# EAGLE design hat_v2 (EAGLE 9.0.1)
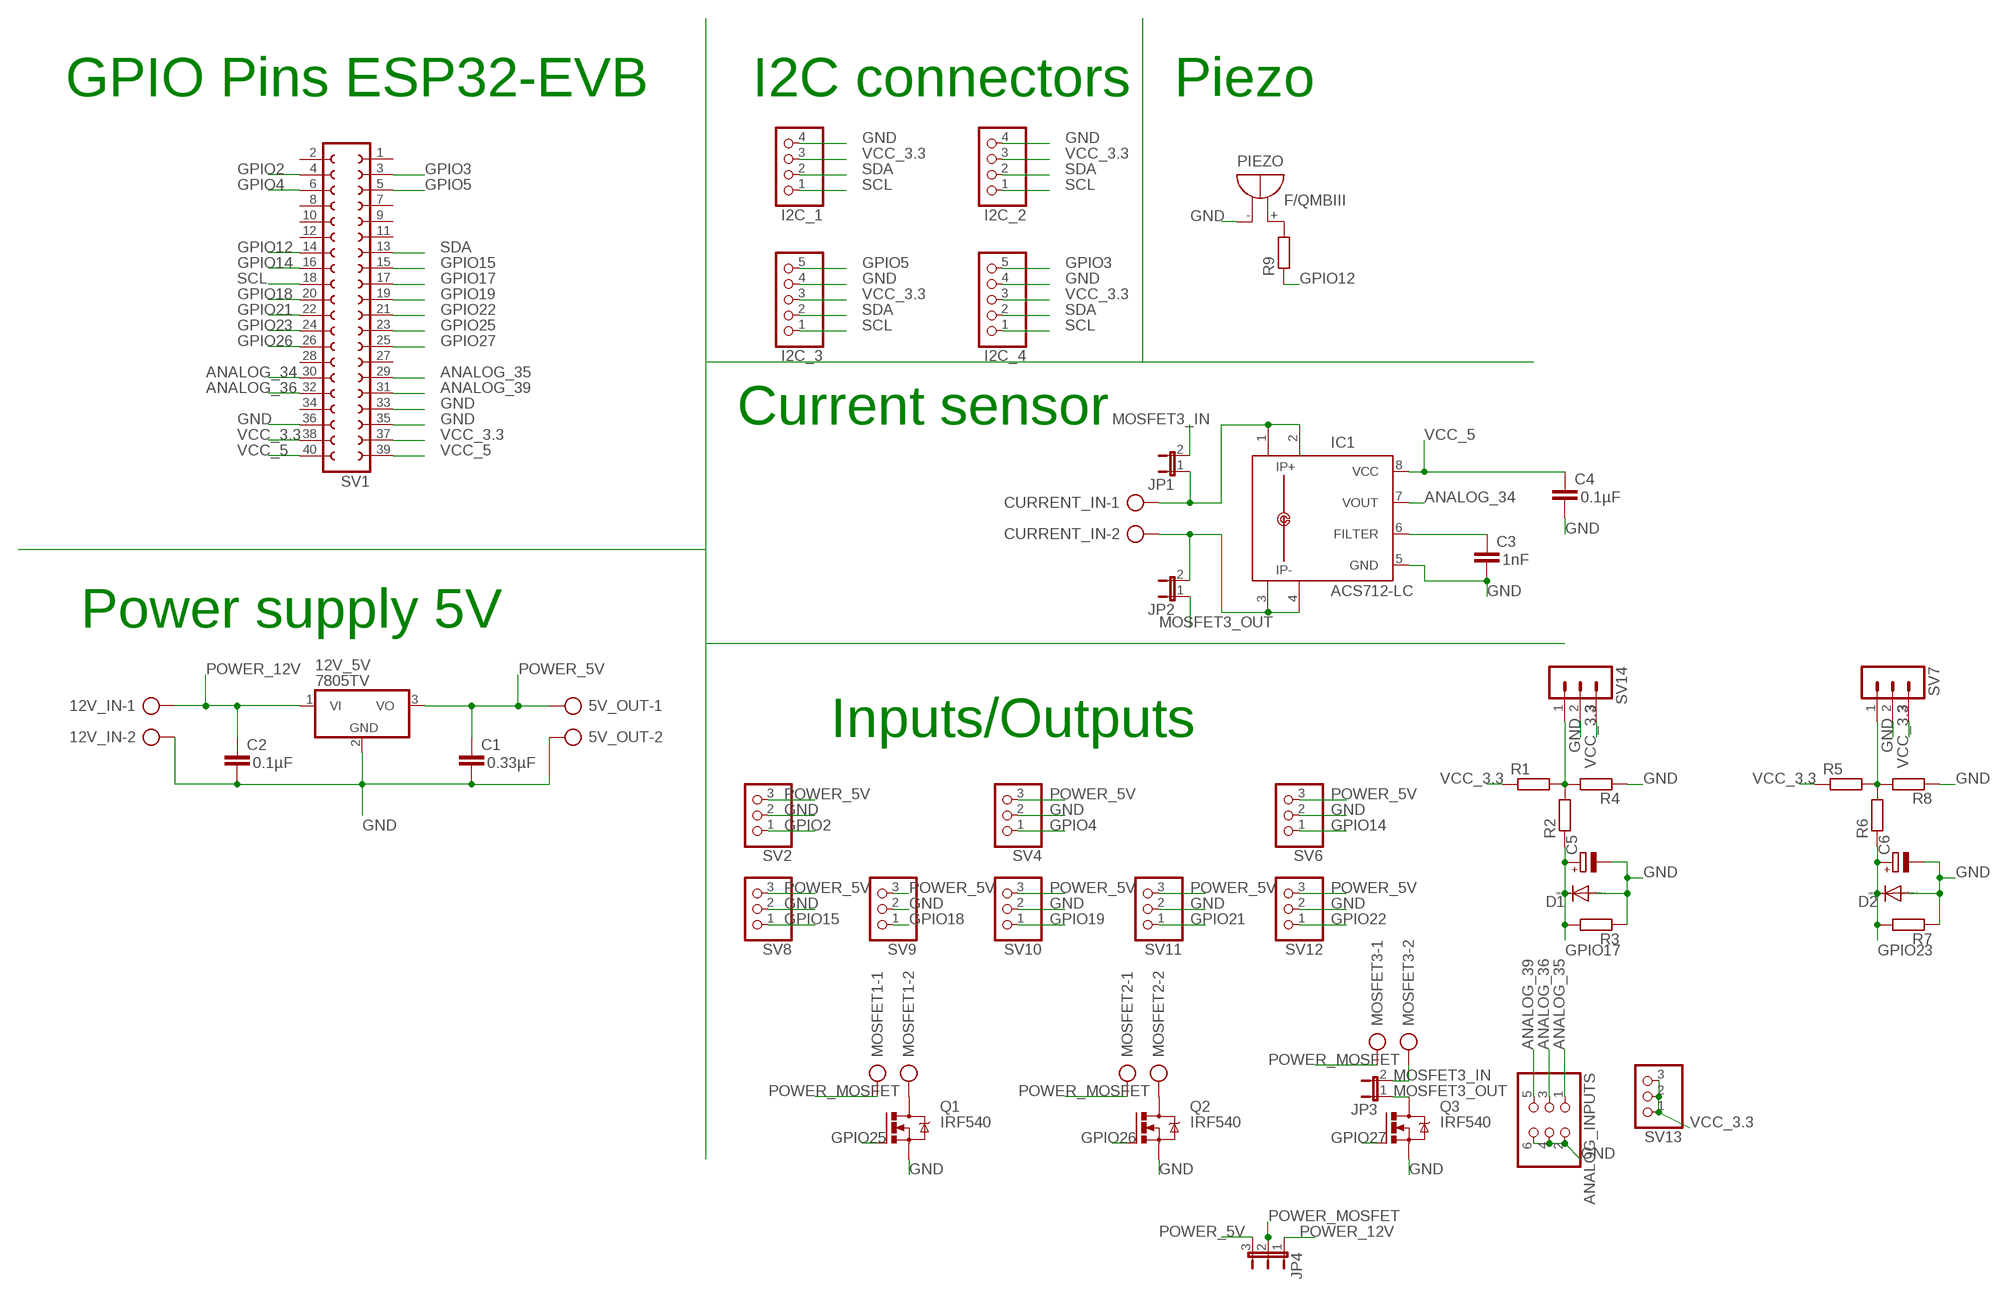
[diagram p0: schematic, sheet 1]

## Parts
5V_OUT  AK500/2  [AK500/2]
12V_5V  7805TV  [TO220V]
12V_IN  AK500/2  [AK500/2]
ANALOG_INPUTS  PINHD-2X3  [2X03]
C1  C-EU050-050X075  [C050-050X075]
C2  C-EU050-035X075  [C050-035X075]
C3  C-EU025-025X050  [C025-025X050]
C4  C-EU025-025X050  [C025-025X050]
C5  CPOL-EUE2.5-6  [E2,5-6]
C6  CPOL-EUE2.5-6  [E2,5-6]
CURRENT_IN  AK500/2  [AK500/2]
D1  DIODE-C1702-05  [C1702-05]
D2  DIODE-C1702-05  [C1702-05]
I2C_1  PINHD-1X4  [1X04]
I2C_2  PINHD-1X4  [1X04]
I2C_3  PINHD-1X5  [1X05]
I2C_4  PINHD-1X5  [1X05]
IC1  ACS712-LC  [SOIC8]
JP1  JP1E  [JP1]
JP2  JP1E  [JP1]
JP3  JP1E  [JP1]
JP4  JP2E  [JP2]
MOSFET1  AK500/2  [AK500/2]
MOSFET2  AK500/2  [AK500/2]
MOSFET3  AK500/2  [AK500/2]
PIEZO  F/QMBIII  [F/QMBIII]
Q1  IRF540  [TO220BV]
Q2  IRF540  [TO220BV]
Q3  IRF540  [TO220BV]
R1  R-EU_0207/2V  [0207/2V]
R2  R-EU_0207/2V  [0207/2V]
R3  R-EU_0207/2V  [0207/2V]
R4  R-EU_0617/5V  [0617V]
R5  R-EU_0207/2V  [0207/2V]
R6  R-EU_0207/2V  [0207/2V]
R7  R-EU_0207/2V  [0207/2V]
R8  R-EU_0617/5V  [0617V]
R9  R-EU_0207/5V  [0207/5V]
SV1  FE20-2  [FE20-2]
SV2  PINHD-1X3  [1X03]
SV4  PINHD-1X3  [1X03]
SV6  PINHD-1X3  [1X03]
SV7  MA03-1  [MA03-1]
SV8  PINHD-1X3  [1X03]
SV9  PINHD-1X3  [1X03]
SV10  PINHD-1X3  [1X03]
SV11  PINHD-1X3  [1X03]
SV12  PINHD-1X3  [1X03]
SV13  PINHD-1X3  [1X03]
SV14  MA03-1  [MA03-1]

## Nets
ANALOG_34: IC1.7(VOUT) SV1.30
ANALOG_35: ANALOG_INPUTS.1 SV1.29
ANALOG_36: ANALOG_INPUTS.3 SV1.32
ANALOG_39: ANALOG_INPUTS.5 SV1.31
GND: 5V_OUT.2 12V_5V.2(GND) 12V_IN.2 ANALOG_INPUTS.2 ANALOG_INPUTS.4 ANALOG_INPUTS.6 C1.2 C2.2 C3.2 C4.2 C5.- C6.- D1.A D2.A I2C_1.4 I2C_2.4 I2C_3.4 I2C_4.4 IC1.5(GND) PIEZO.-(+) Q1.S Q2.S Q3.S R3.1 R4.1 R7.1 R8.1 SV1.33 SV1.35 SV1.36 SV2.2 SV4.2 SV6.2 SV7.2 SV8.2 SV9.2 SV10.2 SV11.2 SV12.2 SV14.2
GPIO2: SV1.4 SV2.1
GPIO3: I2C_4.5 SV1.3
GPIO4: SV1.6 SV4.1
GPIO5: I2C_3.5 SV1.5
GPIO12: R9.1 SV1.14
GPIO14: SV1.16 SV6.1
GPIO15: SV1.15 SV8.1
GPIO17: C5.+ D1.C R2.1 R3.2 SV1.17
GPIO18: SV1.20 SV9.1
GPIO19: SV1.19 SV10.1
GPIO21: SV1.22 SV11.1
GPIO22: SV1.21 SV12.1
GPIO23: C6.+ D2.C R6.1 R7.2 SV1.24
GPIO25: Q1.G SV1.23
GPIO26: Q2.G SV1.26
GPIO27: Q3.G SV1.25
MOSFET3_IN: JP1.2 JP3.2 MOSFET3.2
MOSFET3_OUT: JP2.1 JP3.1 Q3.D
N$4: MOSFET1.2 Q1.D
N$5: MOSFET2.2 Q2.D
N$7: CURRENT_IN.1 IC1.1(IP+) IC1.2(IP+1) JP1.1
N$8: CURRENT_IN.2 IC1.3(IP-) IC1.4(IP-1) JP2.2
N$9: R1.2 R2.2 R4.2 SV14.1
N$10: R5.2 R6.2 R8.2 SV7.1
N$11: C3.1 IC1.6(FILTER)
N$12: PIEZO.+(-) R9.2
POWER_5V: 5V_OUT.1 12V_5V.3(VO) C1.1 JP4.3 SV2.3 SV4.3 SV6.3 SV8.3 SV9.3 SV10.3 SV11.3 SV12.3
POWER_12V: 12V_5V.1(VI) 12V_IN.1 C2.1 JP4.1
POWER_MOSFET: JP4.2 MOSFET1.1 MOSFET2.1 MOSFET3.1
SCL: I2C_1.1 I2C_2.1 I2C_3.1 I2C_4.1 SV1.18
SDA: I2C_1.2 I2C_2.2 I2C_3.2 I2C_4.2 SV1.13
VCC_3.3: I2C_1.3 I2C_2.3 I2C_3.3 I2C_4.3 R1.1 R5.1 SV1.37 SV1.38 SV7.3 SV13.1 SV13.2 SV13.3 SV14.3
VCC_5: C4.1 IC1.8(VCC) SV1.39 SV1.40
Unconnected: SV1.1 SV1.2 SV1.7 SV1.8 SV1.9 SV1.10 SV1.11 SV1.12 SV1.27 SV1.28 SV1.34

## Notes on the sheet
- GPIO Pins ESP32-EVB | I2C connectors | Piezo
- Current sensor
- Power supply 5V
- Inputs/Outputs

## Library data of the parts
5V_OUT 12V_IN CURRENT_IN MOSFET1-MOSFET3 = con-ptr500:AK500/2: CONNECTOR; OC_FARNELL: unknown; OC_NEWARK: unknown
12V_5V = linear:78*: Positive VOLTAGE REGULATOR Source: http://cache.national.com/ds/LM/LM78L05.pdf http://www.fairchildsemi.com/ds/LM/LM7805.pdf
ANALOG_INPUTS = pinhead:PINHD-2X3: PIN HEADER
C1 = resistor:C-EU: CAPACITOR, European symbol; C1: 0.33µF
C2 = resistor:C-EU: CAPACITOR, European symbol; C2: 0.1µF
C3 = rcl:C-EU: CAPACITOR, European symbol; SPICEPREFIX: 1nF
C4 = rcl:C-EU: CAPACITOR, European symbol; SPICEPREFIX: 0.1µF
C5 C6 = rcl:CPOL-EU: POLARIZED CAPACITOR, European symbol; SPICEPREFIX: C
D1 D2 = diode:DIODE-: DIODE
I2C_1 I2C_2 = pinhead:PINHD-1X4: PIN HEADER
I2C_3 I2C_4 = pinhead:PINHD-1X5: PIN HEADER
IC1 = allegro-2:ACS712-LC
JP1-JP3 = jumper:JP1E: JUMPER
JP4 = jumper:JP2E: JUMPER
PIEZO = buzzer:F/QMBIII: BUZZER Source: Buerklin; OC_FARNELL: unknown; OC_NEWARK: unknown
Q1-Q3 = transistor-power:IRF540: HEXFET Power MOSFET
R1-R9 = rcl:R-EU_: RESISTOR, European symbol; SPICEPREFIX: R
SV1 = con-lsta:FE20-2: FEMALE HEADER; OC_FARNELL: unknown; OC_NEWARK: unknown
SV2 SV4 SV6 SV9-SV12 = pinhead:PINHD-1X3: PIN HEADER; SPICEPREFIX: J
SV7 SV14 = con-lstb:MA03-1: PIN HEADER; OC_FARNELL: unknown; OC_NEWARK: unknown; SPICEPREFIX: J
SV8 SV13 = pinhead:PINHD-1X3: PIN HEADER

## Board
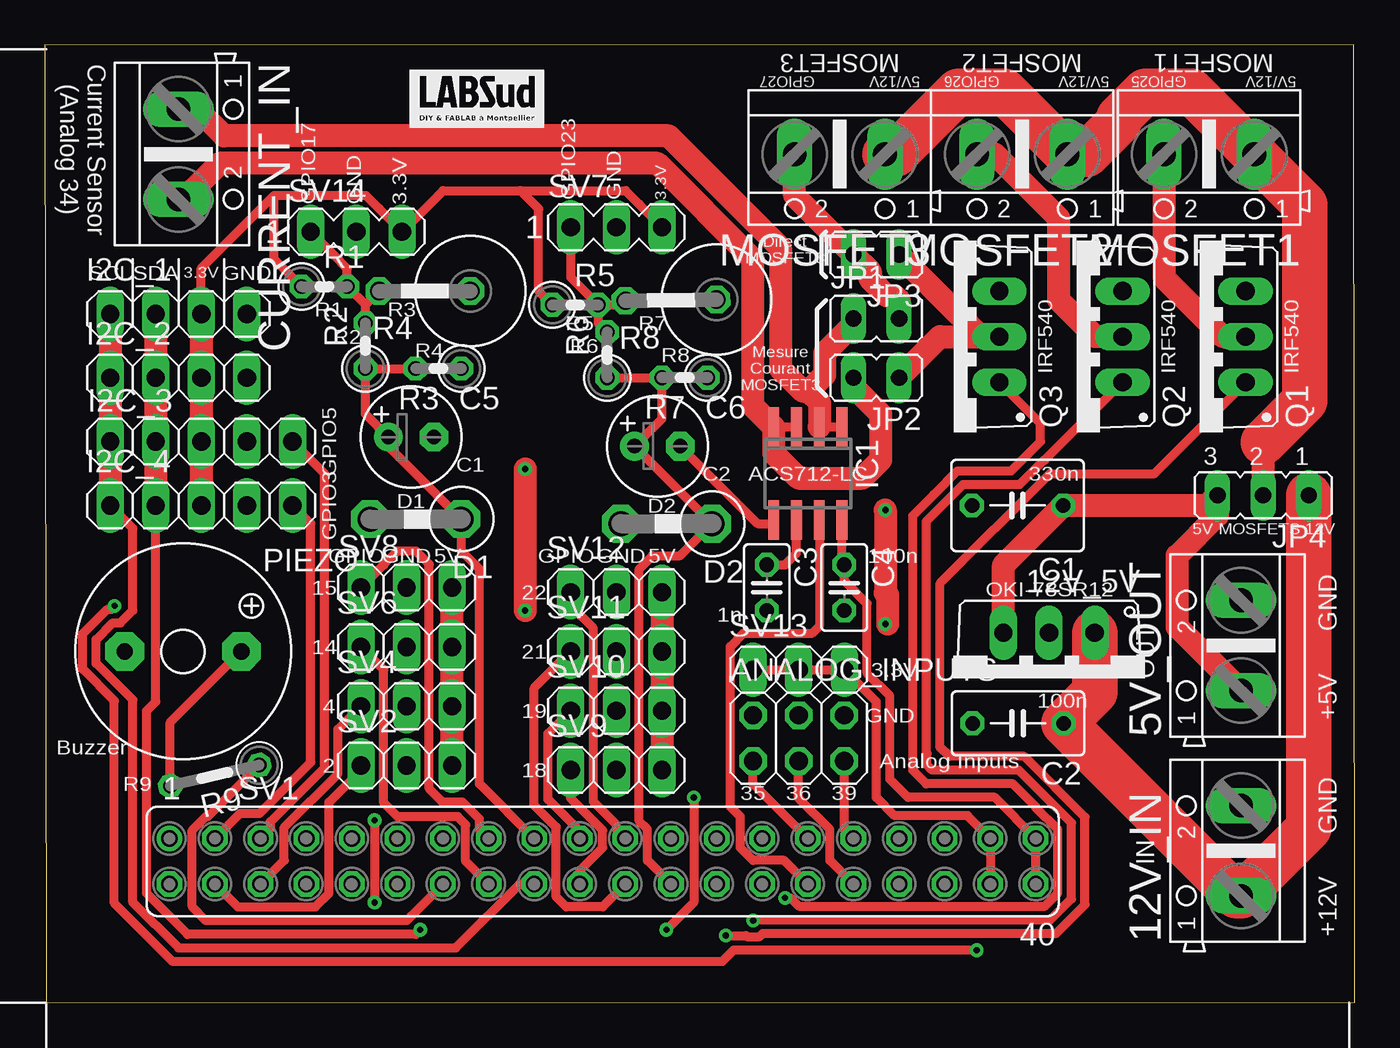
[diagram p1: board, top side]
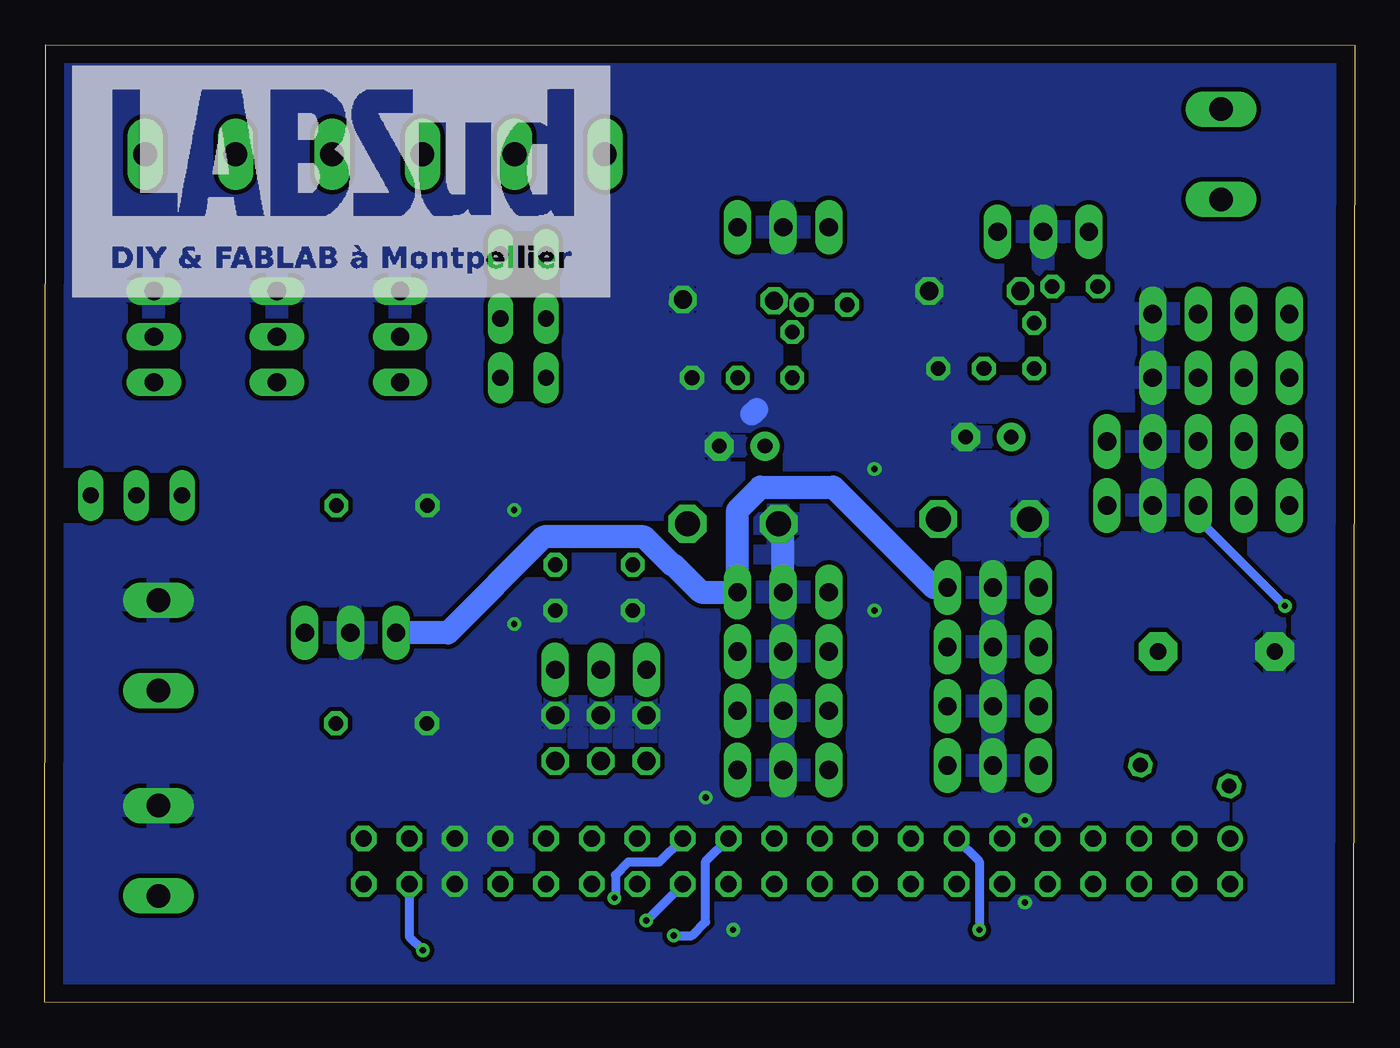
[diagram p2: board, bottom side, seen from below]

Size 72.95 x 53.33 mm. Coordinates in mm from the lower left corner, seen from the top.
Outline: 0.08,0 72.95,0.04 72.9,53.33 0,53.3 0.08,0
Copper layers (1*16): Top 0.035mm / dielectric 1.5mm / Bottom 0.035mm
Design rules "default *": minimum track width 6mil, minimum drill 0.35mm, track to track 10mil, track to pad 10mil, pad to pad 10mil, via to via 10mil, smd to smd 10mil, copper to edge 40mil, drill to drill 6mil, minimum pad ring 10mil, minimum via ring 8mil, stop-mask expansion 4mil, vias tented up to drill 0mil, thermal gap 10mil

### Footprints (pad centres in the part's own frame; a part is rotated, then mirrored left to right if it is on the bottom)
AK500/2 = drill 1.321 long: 1 -2.515,0; 2 2.515,0
TO220V = drill 1.016 long: 1 -2.54,-2.54; 2 0,-2.54; 3 2.54,-2.54
2X03 = drill 1.016 octagon: 1 -2.54,-1.27; 2 -2.54,1.27; 3 0,-1.27; 4 0,1.27; 5 2.54,-1.27; 6 2.54,1.27
C050-050X075 = drill 0.813 octagon: 1 -2.54,0; 2 2.54,0
C050-035X075 = drill 0.813 octagon: 1 -2.54,0; 2 2.54,0
C025-025X050 = drill 0.813 octagon: 1 -1.27,0; 2 1.27,0
E2,5-6 = drill 0.813 pad 1.6: + -1.27,0 | drill 0.813 pad 1.6 octagon: - 1.27,0
C1702-05 = drill 1.397 octagon: A 2.54,0; C -2.54,0
1X04 = drill 1.016 long: 1 -3.81,0; 2 -1.27,0; 3 1.27,0; 4 3.81,0
1X05 = drill 1.016 long: 1 -5.08,0; 2 -2.54,0; 3 0,0; 4 2.54,0; 5 5.08,0
SOIC8 = smd 0.6 x 2.2: 1 -1.905,-2.6; 2 -0.635,-2.6; 3 0.635,-2.6; 4 1.905,-2.6; 5 1.905,2.6; 6 0.635,2.6; 7 -0.635,2.6; 8 -1.905,2.6
JP1 = drill 0.914 long: 1 0,-1.27; 2 0,1.27
JP2 = drill 0.914 long: 1 -2.54,0; 2 0,0; 3 2.54,0
F/QMBIII = drill 0.914 pad 2.159 octagon: + 3.251,0; - -3.251,0
TO220BV = drill 1.016 long: D 0,-2.54; G -2.54,-2.54; S 2.54,-2.54
0207/2V = drill 0.813 octagon: 1 -1.27,0; 2 1.27,0
0617V = drill 1.016 octagon: 1 -2.54,0; 2 2.54,0
0207/5V = drill 0.813 octagon: 1 -2.54,0; 2 2.54,0
FE20-2 = drill 0.914: 1 -24.13,1.27 | drill 0.914 octagon: 2 -24.13,-1.27; 3 -21.59,1.27; 4 -21.59,-1.27; 5 -19.05,1.27; 6 -19.05,-1.27; 7 -16.51,1.27; 8 -16.51,-1.27; 9 -13.97,1.27; 10 -13.97,-1.27; 11 -11.43,1.27; 12 -11.43,-1.27; 13 -8.89,1.27; 14 -8.89,-1.27; 15 -6.35,1.27; 16 -6.35,-1.27; 17 -3.81,1.27; 18 -3.81,-1.27; 19 -1.27,1.27; 20 -1.27,-1.27; 21 1.27,1.27; 22 1.27,-1.27; 23 3.81,1.27; 24 3.81,-1.27; 25 6.35,1.27; 26 6.35,-1.27; 27 8.89,1.27; 28 8.89,-1.27; 29 11.43,1.27; 30 11.43,-1.27; 31 13.97,1.27; 32 13.97,-1.27; 33 16.51,1.27; 34 16.51,-1.27; 35 19.05,1.27; 36 19.05,-1.27; 37 21.59,1.27; 38 21.59,-1.27; 39 24.13,1.27; 40 24.13,-1.27
1X03 = drill 1.016 long: 1 -2.54,0; 2 0,0; 3 2.54,0
MA03-1 = drill 1.016 long: 1 -2.54,0; 2 0,0; 3 2.54,0

### Placement (x,y rotation side)
5V_OUT  66.62,19.89 90 top
12V_5V  55.93,18.06 180 top
12V_IN  66.62,8.46 90 top
ANALOG_INPUTS  41.99,14.73 0 top
C1  54.18,27.69 180 top
C2  54.2,15.56 180 top
C3  40.21,23.11 270 top
C4  44.53,23.11 270 top
C5  20.4,31.5 0 top
C6  34.11,30.99 0 top
CURRENT_IN  7.44,47.24 270 top
D1  20.65,26.92 180 top
D2  34.62,26.67 180 top
I2C_1  7.44,38.35 0 top
I2C_2  7.44,34.8 0 top
I2C_3  8.71,31.24 0 top
I2C_4  8.71,27.69 0 top
IC1  42.49,29.46 180 top
JP1  46.3,38.1 270 top
JP2  46.3,34.8 90 top
JP3  46.3,41.66 90 top
JP4  67.85,28.25 180 top
MOSFET1  64.85,47.24 180 top
MOSFET2  54.43,47.24 180 top
MOSFET3  44.27,47.24 180 top
PIEZO  7.7,19.56 0 top
Q1  64.34,37.08 90 top
Q2  57.48,37.08 90 top
Q3  50.62,37.08 90 top
R1  15.57,39.88 0 top
R2  17.86,36.58 90 top
R3  21.92,35.31 180 top
R4  21.16,39.62 180 top
R5  29.54,38.86 0 top
R6  31.32,36.07 90 top
R7  35.64,34.8 180 top
R8  34.87,39.12 180.8 top
R9  9.46,12.65 193.2 top
SV1  31.06,7.87 0 top
SV2  20.14,13.21 0 top
SV4  20.14,16.51 0 top
SV6  20.14,19.81 0 top
SV7  31.83,43.18 0 top
SV8  20.14,23.11 0 top
SV9  31.83,12.95 0 top
SV10  31.83,16.26 0 top
SV11  31.83,19.56 0 top
SV12  31.83,22.86 0 top
SV13  41.99,18.54 0 top
SV14  17.35,42.93 0 top
U$1  [LABSUD_MID]  71.46,39.24 0 bottom
U$2  [LABSUD_MINI]  20.31,48.7 0 top

### Tracks (layer width: path | path; a pad name or v marks a point on that pad's centre or on a via)
ANALOG_34
  Top 0.508: SV1.30 41.17,7.92 39.45,7.92 38.74,8.64 38.74,10.36 38.18,10.92 38.18,19.83 38.92,20.57 42.75,20.57 43.13,20.95 IC1.7
ANALOG_35
  Top 0.508: SV1.29 39.45,12.19 ANALOG_INPUTS.1
ANALOG_36
  Top 0.508: SV1.32 43.71,7.92 43.71,9.65 41.99,11.38 ANALOG_INPUTS.3
ANALOG_39
  Top 0.508: SV1.31 44.53,9.65 ANALOG_INPUTS.5
GND  (via drill 0.35)
  Top 0.508: v36.14,11.43 36.14,5.59 v34.62,4.06 | v18.36,10.16 v18.36,5.59 | IC1.5 40.4,26.67 39.7,26.67 C6.-
  Top 1.27: v26.75,29.72 v26.75,21.84 | v46.81,27.43 46.81,22.83 46.94,22.7 46.94,21.08
  Bottom 1.27: 33.57,32.77 33.31,33.02 | SV12.2 31.83,26.42 D2.A
  other vias: 46.81,21.08
  pour Bottom: -3.99,57.3 -4.15,-3.98 76.64,-3.85 76.64,57.11
GPIO2
  Top 0.508: SV1.4 10.74,5.33 15.06,5.33 15.82,6.1 15.82,11.18 17.6,12.95 SV2.1
GPIO3
  Top 0.508: 14.31,27.16 I2C_4.5 14.81,26.67 14.81,13.39 11.96,10.54 10.87,10.54 SV1.3
GPIO4
  Top 0.508: SV4.1 16.33,15.24 16.33,12.76 13.34,9.76 13.34,7.92 SV1.6
GPIO5
  Top 0.508: SV1.5 12.57,9.7 12.57,10.08 15.57,13.08 15.57,29.46 I2C_3.5
GPIO12
  Top 0.508: SV1.14 20.4,4.83 20.4,4.81 20.16,4.57 8.97,4.57 8.2,5.33 8.2,9.6 8.97,10.36 9.07,10.36 R9.1
GPIO14
  Top 0.508: SV1.16 23.44,7.87 23.44,9.91 22.99,10.36 19.63,10.36 18.87,11.12 18.87,18.54 SV6.1
GPIO15
  Top 0.508: SV1.15 24.21,9.65 24.21,10.22 23.25,11.18 22.16,11.18 21.41,11.92 21.41,24.4 20.67,25.15 19.62,25.15 18.87,24.4 18.87,24.38 SV8.1
GPIO17
  Top 0.508: R3.2 R2.1 17.86,32.77 C5.+ 19.13,30.99 D1.C 23.21,26.91 23.21,25.15 24.21,24.15 24.21,12.19 SV1.17
GPIO18
  Top 0.508: SV1.20 29.79,7.37 31.06,8.64 31.06,9.6 29.29,11.38 SV9.1
GPIO19
  Top 0.508: SV1.19 29.79,9.54 28.02,11.32 28.02,14.99 SV10.1
GPIO21
  Top 0.508: SV1.22 31.06,5.33 29.03,5.33 28.47,5.89 28.47,9.78 27.25,11 27.25,17.53 SV11.1
GPIO22
  Top 0.508: SV1.21 31.83,9.65 31.83,9.92 30.56,11.19 30.56,20.85 29.29,22.12 SV12.1
GPIO23
  Top 0.508: SV1.24 33.55,7.92 33.55,9.65 33.1,10.11 33.1,24.15 33.84,24.89 35.38,24.89 D2.C C6.+ 34.37,32.51 R7.2 R6.1
GPIO25  (via drill 0.35)
  Top 0.508: 38,3.81 v37.92,3.74 39.03,3.74 39.08,3.69 39.81,3.69 39.99,3.86 56.33,3.86 57.94,5.47 57.94,10.33 54.56,13.72 50.37,13.72 49.86,14.22 49.86,23.34 55.98,29.46 61.8,29.46 Q1.G
  Bottom 0.508: SV1.23 36.14,7.87 36.14,4.5 36.91,3.74 v37.92,3.74
GPIO26  (via drill 0.35)
  Top 0.508: 49.13,13.24 49.41,12.95 54.24,12.95 57.18,10.02 57.18,5.78 56.02,4.62 39.5,4.62 v39.45,4.57 | 49.13,13.24 49.1,13.27 | 49.13,13.24 49.13,13.88 49.1,13.91 49.1,26.8 51.15,28.85 54.29,28.85 55.67,30.23 55.7,30.23 Q2.G
  Bottom 0.508: v39.45,4.57 SV1.26
GPIO27  (via drill 0.35)
  Top 0.508: v41.22,5.84 41.53,5.84 41.99,5.38 55.7,5.38 56.41,6.1 56.41,9.65 55.19,10.87 55.19,10.92 53.92,12.19 49.1,12.19 48.34,12.95 48.34,27.11 49.51,28.29 50.84,29.62 53.82,29.62 55.45,31.24 55.45,32.26 Q3.G
  Bottom 0.508: SV1.25 38.74,7.82 40.46,7.82 41.17,7.11 41.17,5.89 v41.22,5.84
MOSFET3_IN
  Top 1.27: JP1.2 47.57,39.12 47.35,39.34 46.91,39.34 45.97,40.28 45.97,40.72 JP3.2 41.76,44.93 MOSFET3.2
MOSFET3_OUT
  Top 1.27: Q3.D 51.89,37.08 | JP2.1 49.86,37.08 Q3.D | JP3.1 52.15,37.08 Q3.D
N$4
  Top 1.27: MOSFET1.2 62.33,40.41 62.43,40.31 62.43,40.26 65.61,37.08 Q1.D
N$5
  Top 1.27: Q2.D 58.5,37.08 56.46,39.12 56.46,43.69 52.91,47.24 MOSFET2.2
N$7
  Top 0.508: IC1.2 IC1.1
  Top 1.27: CURRENT_IN.1 8.48,49.76 9.98,48.26 34.74,48.26 40.97,42.03 40.97,35.31 42.22,34.05 42.53,34.05 | 42.53,34.05 43.13,33.45 IC1.2 | 42.53,34.05 43.43,34.96 43.43,36.17 45.03,37.77 JP1.1
N$8
  Top 0.508: IC1.4 IC1.3
  Top 1.27: JP2.2 45.03,34.29 46.56,32.77 46.56,30.23 45.54,29.21 41.99,29.21 40.59,30.61 IC1.4 39.45,33.21 39.45,41.4 34.11,46.74 9.73,46.74 7.72,44.73 CURRENT_IN.2
N$9
  Top 0.508: R2.2 17.86,38.86 | SV14.1 16.08,41.66 16.08,41.64 16.84,40.88 R1.2 17.86,38.86 | 17.86,38.86 R4.2
N$10
  Top 0.508: R5.2 32.12,38.86 R8.2 | SV7.1 29.29,40.39 R5.2 | R5.2 30.81,37.85 R6.2
N$11
  Top 0.508: C3.1 41.22,24.38 41.86,25.02 IC1.6
N$12
  Top 0.508: R9.2 6.99,15.62 10.92,19.56 PIEZO.+
POWER_5V
  Top 1.27: SV12.3 SV11.3 SV10.3 SV9.3 | SV2.3 SV4.3 SV6.3 SV8.3 | 5V_OUT.1 63.07,20.93 63.07,24.89 65.31,27.14 JP4.3 64.75,27.69 C1.1 53.39,24.36 12V_5V.3
  Bottom 1.27: SV8.3 23.44,23.11 29.03,28.7 33.1,28.7 34.37,27.43 SV12.3 36.4,22.86 37.92,24.38 38.02,24.38 39.57,25.93 45.17,25.93 50.5,20.6 12V_5V.3
POWER_12V
  Top 2.54: JP4.1 70.39,9.72 12V_IN.1 66.35,5.95 C2.1 58.47,17.29 12V_5V.1
POWER_MOSFET
  Top 1.27: JP4.2 67.85,31.2
  Top 2.54: MOSFET3.1 47.37,47.24 50.88,50.75 53.44,50.75 MOSFET2.1 58.04,47.24 59.82,49.02 59.82,49.28 61.29,50.75 63.86,50.75 MOSFET1.1 70.18,44.42 70.18,33.53 67.85,31.2
SCL
  Top 0.508: I2C_4.1 4.9,26.42 4.9,21.84 4.2,21.14 3.79,21.14 2.86,20.22 2.86,18.9 4.9,16.86 4.9,5.59 7.44,3.05 22.88,3.05 26.44,6.6 SV1.18
  Top 1.27: I2C_1.1 I2C_2.1 I2C_3.1 I2C_4.1
SDA  (via drill 0.35)
  Top 0.508: v20.9,4.06 20.65,3.81 7.95,3.81 5.66,6.1 5.66,16.26 6.17,16.76 I2C_4.2
  Top 1.27: I2C_1.2 I2C_2.2 I2C_3.2 I2C_4.2
  Bottom 0.508: SV1.13 20.9,7.87 v20.9,4.06
VCC_3.3  (via drill 0.35)
  Top 0.508: SV1.38 SV1.37 51.38,10.41 47.32,10.41 46.3,11.43 46.3,16.76 SV13.3 SV13.2 SV13.1 | v51.89,2.92 38.36,2.92 37.73,2.29 7.13,2.29 3.87,5.54 3.87,16.81 2.1,18.59 2.1,20.53 3.47,21.91 3.7,21.91 v3.89,22.1 | I2C_1.3 8.71,40.89 12.78,44.96 | 12.78,44.96 17.87,44.96 18.62,44.21 18.62,44.2 SV14.3 22.17,45.21 26.49,45.21 | SV7.3 33.1,44.45 33.1,44.47 32.35,45.21 26.49,45.21 | R5.1 27.51,39.62 27.51,44.2 26.49,45.21 | R1.1 12.78,41.4 12.78,44.96
  Top 1.27: I2C_1.3 I2C_2.3 I2C_3.3 I2C_4.3
  Bottom 0.508: SV1.38 52.65,3.69 v51.89,2.92 | v3.89,22.1 8.71,26.92 I2C_4.3
VCC_5
  Top 0.508: SV1.40 SV1.39 52.91,11.43 48.08,11.43 47.07,12.45 47.07,17.08 45.8,18.35 45.8,22.23 44.53,23.5 C4.1 44.4,24.51 IC1.8

### Text on the board
tPlace: MOSFET3 | MOSFET2 | MOSFET1 | 5V/12V GPIO27 | 5V/12V GPIO26 | 5V/12V GPIO25 | Current Sensor / (Analog 34) | GPIO23 | GND | 3.3V | GPIO17 | GND | 3.3V | Direct / MOSFET3 | SCL | SDA | 3.3V | GND | R1 | R3 | R5 | R7 | R2 | R6 | IRF540 | IRF540 | IRF540 | R4 | R8 | Mesure / Courant / MOSFET3 | GPIO5 | C1 | C2 | ACS712-LC | 330n | GPIO3 | D1 | D2 | 5V MOSFETS 12V | GPIO | GND | 5V | GPIO | GND | 5V | 100n | 15 | 22 | OKI-78SR12 | 1n | 14 | 21 | OUT | +5V GND | 3.3V | 4 | 100n | 19 | GND | Buzzer | 2 | 18 | Analog Inputs | R9 | 35 | 36 | 39 | IN | +12V GND